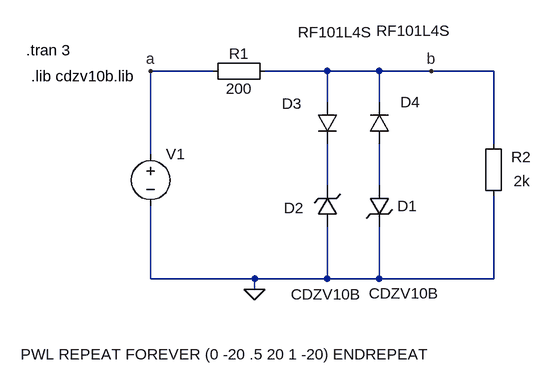
[diagram p0: schematic VL-S-B1.asc]
VL-S-B1.asc, the LTspice schematic file:
Version 4
SHEET 1 880 680
WIRE -16 -16 -112 -16
WIRE 160 -16 64 -16
WIRE 240 -16 160 -16
WIRE 320 -16 240 -16
WIRE 416 -16 320 -16
WIRE 160 32 160 -16
WIRE 240 32 240 -16
WIRE 416 96 416 -16
WIRE -112 112 -112 -16
WIRE 160 160 160 96
WIRE 240 160 240 96
WIRE -112 304 -112 192
WIRE 48 304 -112 304
WIRE 160 304 160 224
WIRE 160 304 48 304
WIRE 240 304 240 224
WIRE 240 304 160 304
WIRE 416 304 416 176
WIRE 416 304 240 304
WIRE 48 320 48 304
FLAG -112 -16 a
FLAG 320 -16 b
FLAG 48 320 0
SYMBOL Misc\\EuropeanResistor 432 192 R180
WINDOW 0 -42 76 Left 2
WINDOW 3 -41 39 Left 2
SYMATTR InstName R2
SYMATTR Value 2k
SYMBOL voltage -112 96 R0
WINDOW 3 -200 324 Left 2
SYMATTR Value PWL REPEAT FOREVER (0 -20 .5 20 1 -20) ENDREPEAT
SYMATTR InstName V1
SYMBOL zener 176 224 R180
WINDOW 0 52 29 Left 2
WINDOW 3 -36 -104 Left 2
SYMATTR InstName D2
SYMATTR Value CDZV10B
SYMATTR Description Diode
SYMATTR Type diode
SYMBOL zener 224 160 R0
WINDOW 0 44 32 Left 2
WINDOW 3 0 166 Left 2
SYMATTR InstName D1
SYMATTR Value CDZV10B
SYMATTR Description Diode
SYMATTR Type diode
SYMBOL Misc\\EuropeanResistor -32 0 R270
WINDOW 0 27 56 VTop 2
WINDOW 3 5 56 VBottom 2
SYMATTR InstName R1
SYMATTR Value 200
SYMBOL diode 144 32 R0
WINDOW 0 -54 2 Left 2
WINDOW 3 -29 -108 Left 2
SYMATTR InstName D3
SYMATTR Value RF101L4S
SYMBOL diode 256 96 R180
WINDOW 0 -47 64 Left 2
WINDOW 3 -95 174 Left 2
SYMATTR InstName D4
SYMATTR Value RF101L4S
TEXT -304 -48 Left 2 !.tran 3
TEXT -296 -8 Left 2 !.lib cdzv10b.lib

The netlist it stands for:
* VL-S-B1.asc
R2 0 b 2k
V1 a 0 PWL REPEAT FOREVER (0 -20 .5 20 1 -20) ENDREPEAT
D2 0 N001 CDZV10B
D1 N002 0 CDZV10B
R1 a b 200
D3 b N001 RF101L4S
D4 N002 b RF101L4S
.model D D
.lib standard.dio
.tran 3
.lib cdzv10b.lib
.backanno
.end